# Altium schematic sheet pca10028_connectors.SchDoc: PCA10028 - Connectors
size A4; Revision: 1.0.0; SheetNumber: 4; SheetTotal: 5; DrawnBy: RUBR; ProjectNumber: 4403; PCBRevision: 0169RUBR; DocumentSize: A4; PCAName: PCA10028; PCBNumber: 400092; ProjectName: Cost optimized nRF51-EK
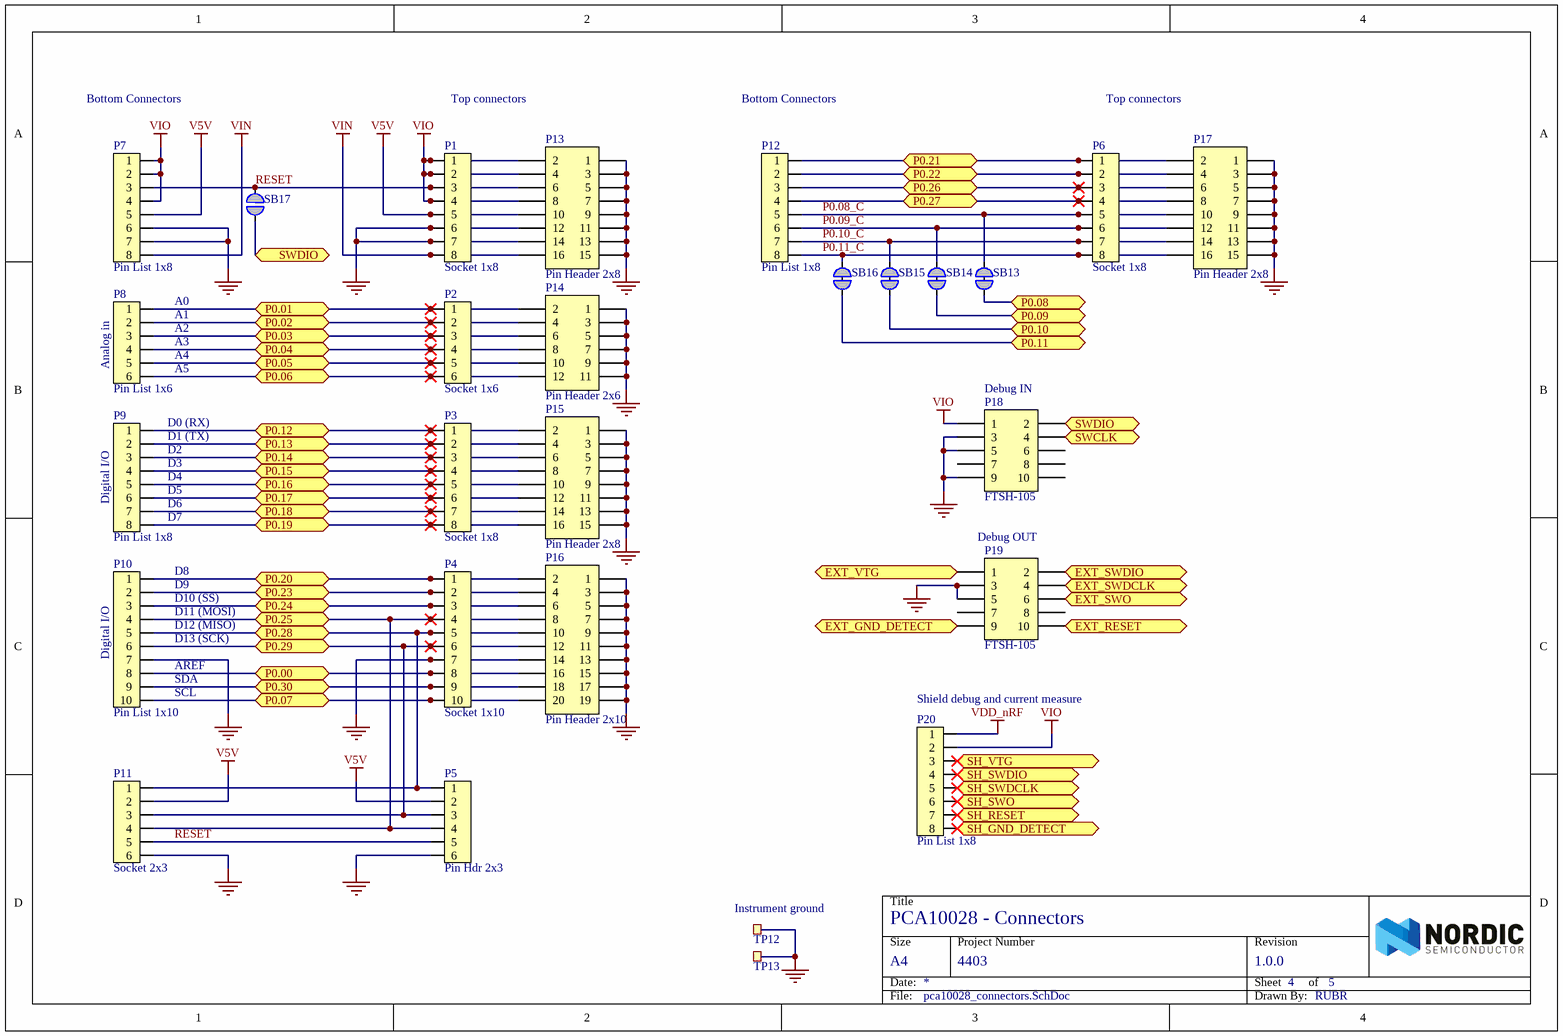
[diagram p0: pca10028_connectors.SchDoc]

## Parts
P1  Socket 1x8  [SOCKET_1x8_SMD]
P2  Socket 1x6  [SOCKET_1x6_SMD]
P3  Socket 1x8  [SOCKET_1x8_SMD]
P4  Socket 1x10  [SOCKET_1x10_SMD]
P5  Pin Hdr 2x3  [Molex 15-91-2060]
P6  Socket 1x8  [SOCKET_1x8_SMD]
P7  Pin List 1x8  [LIST_1x8_SMD]
P8  Pin List 1x6  [LIST_1x6_SMD]
P9  Pin List 1x8  [LIST_1x8_SMD]
P10  Pin List 1x10  [LIST_1x10_SMD]
P11  Socket 2x3  [SOCKET_2x3_SMD-2.54mm-bottom]
P12  Pin List 1x8  [LIST_1x8_SMD]
P13  Pin Header 2x8  [HDR_2x8]
P14  Pin Header 2x6  [HDR_2x6]
P15  Pin Header 2x8  [HDR_2x8]
P16  Pin Header 2x10  [HDR_2x10]
P17  Pin Header 2x8  [HDR_2x8]
P18  FTSH-105  [FTSH-105-K]
P19  FTSH-105  [FTSH-105-K]
P20  Pin List 1x8  [LIST_1x8_SMD]
SB13  Solderbridge  [Solderbridge_Shorted]  (value not drawn)  (net tie, no BOM)
SB14  Solderbridge  [Solderbridge_Shorted]  (value not drawn)  (net tie, no BOM)
SB15  Solderbridge  [Solderbridge_Shorted]  (value not drawn)  (net tie, no BOM)
SB16  Solderbridge  [Solderbridge_Shorted]  (value not drawn)  (net tie, no BOM)
SB17  Solderbridge  [Solderbridge]  (value not drawn)  (no BOM)
TP12  TP  [TESTPAD-TH]  (value not drawn)  (no BOM)
TP13  TP  [TESTPAD-TH]  (value not drawn)  (no BOM)

## Ports
EXT_GND_DETECT (bidir), EXT_RESET (bidir), EXT_SWDCLK (bidir), EXT_SWDIO (bidir), EXT_SWO (bidir), EXT_VTG (bidir), P0.00 (bidir), P0.01 (bidir), P0.02 (bidir), P0.03 (bidir), P0.04 (bidir), P0.05 (bidir), P0.06 (bidir), P0.07 (bidir), P0.08 (bidir), P0.09 (bidir), P0.10 (bidir), P0.11 (bidir), P0.12 (bidir), P0.13 (bidir), P0.14 (bidir), P0.15 (bidir), P0.16 (bidir), P0.17 (bidir), P0.18 (bidir), P0.19 (bidir), P0.20 (bidir), P0.21 (bidir), P0.22 (bidir), P0.23 (bidir), P0.24 (bidir), P0.25 (bidir), P0.26 (bidir), P0.27 (bidir), P0.28 (bidir), P0.29 (bidir), P0.30 (bidir), SH_GND_DETECT (bidir), SH_RESET (bidir), SH_SWDCLK (bidir), SH_SWDIO (bidir), SH_SWO (bidir), SH_VTG (bidir), SWCLK (out), SWDIO (bidir)

## Nets
GND: P1.6 P1.7 P4.7 P5.6 P7.6 P7.7 P10.7 P11.6 P13.1 P13.3 P13.5 P13.7 P13.9 P13.11 P13.12 P13.13 P13.14 P13.15 P14.1 P14.3 P14.5 P14.7 P14.9 P14.11 P15.1 P15.3 P15.5 P15.7 P15.9 P15.11 P15.13 P15.15 P16.1 P16.3 P16.5 P16.7 P16.9 P16.11 P16.13 P16.14 P16.15 P16.17 P16.19 P17.1 P17.3 P17.5 P17.7 P17.9 P17.11 P17.13 P17.15 P18.3 P18.5 P18.9 P19.3 P19.5 TP12.1 TP13.1
V5V: P1.5 P5.2 P7.5 P11.2 P13.10
VDD_nRF: P20.1
VIN: P1.8 P7.8 P13.16
VIO: P1.1 P1.2 P1.4 P7.1 P7.2 P7.4 P13.2 P13.4 P13.8 P18.1 P20.2
EXT_GND_DETECT: P19.9 ; port EXT_GND_DETECT
EXT_RESET: P19.10 ; port EXT_RESET
EXT_SWDCLK: P19.4 ; port EXT_SWDCLK
EXT_SWDIO: P19.2 ; port EXT_SWDIO
EXT_SWO: P19.6 ; port EXT_SWO
EXT_VTG: P19.1 ; port EXT_VTG
P0.00: P4.8 P10.8 P16.16 ; port P0.00
P0.01: P2.1 P8.1 P14.2 ; port P0.01
P0.02: P2.2 P8.2 P14.4 ; port P0.02
P0.03: P2.3 P8.3 P14.6 ; port P0.03
P0.04: P2.4 P8.4 P14.8 ; port P0.04
P0.05: P2.5 P8.5 P14.10 ; port P0.05
P0.06: P2.6 P8.6 P14.12 ; port P0.06
P0.07: P4.10 P10.10 P16.20 ; port P0.07
P0.08: SB13.2 ; port P0.08
P0.08_C: P6.5 P12.5 P17.10 SB13.1
P0.09: SB14.2 ; port P0.09
P0.09_C: P6.6 P12.6 P17.12 SB14.1
P0.10: SB15.2 ; port P0.10
P0.10_C: P6.7 P12.7 P17.14 SB15.1
P0.11: SB16.2 ; port P0.11
P0.11_C: P6.8 P12.8 P17.16 SB16.1
P0.12: P3.1 P9.1 P15.2 ; port P0.12
P0.13: P3.2 P9.2 P15.4 ; port P0.13
P0.14: P3.3 P9.3 P15.6 ; port P0.14
P0.15: P3.4 P9.4 P15.8 ; port P0.15
P0.16: P3.5 P9.5 P15.10 ; port P0.16
P0.17: P3.6 P9.6 P15.12 ; port P0.17
P0.18: P3.7 P9.7 P15.14 ; port P0.18
P0.19: P3.8 P9.8 P15.16 ; port P0.19
P0.20: P4.1 P10.1 P16.2 ; port P0.20
P0.21: P6.1 P12.1 P17.2 ; port P0.21
P0.22: P6.2 P12.2 P17.4 ; port P0.22
P0.23: P4.2 P10.2 P16.4 ; port P0.23
P0.24: P4.3 P10.3 P16.6 ; port P0.24
P0.25: P4.4 P5.4 P10.4 P11.4 P16.8 ; port P0.25
P0.26: P6.3 P12.3 P17.6 ; port P0.26
P0.27: P6.4 P12.4 P17.8 ; port P0.27
P0.28: P4.5 P5.1 P10.5 P11.1 P16.10 ; port P0.28
P0.29: P4.6 P5.3 P10.6 P11.3 P16.12 ; port P0.29
P0.30: P4.9 P10.9 P16.18 ; port P0.30
RESET: P1.3 P5.5 P7.3 P11.5 P13.6 SB17.1
SH_GND_DETECT: P20.8 ; port SH_GND_DETECT
SH_RESET: P20.7 ; port SH_RESET
SH_SWDCLK: P20.5 ; port SH_SWDCLK
SH_SWDIO: P20.4 ; port SH_SWDIO
SH_SWO: P20.6 ; port SH_SWO
SH_VTG: P20.3 ; port SH_VTG
SWCLK: P18.4 ; port SWCLK
SWDIO: P18.2 SB17.2 ; port SWDIO

Not connected (* = marked no-connect by the designer): P18 6 7 8 10; P19 7 8

## Notes on the sheet
- Bottom Connectors
- Top connectors
- A0
- (near P8) Analog in
- (near P8) A1
- (near P8) A2
- (near P8) A3
- (near P8) A4
- (near P8) A5
- (near P9) D0 (RX)
- (near P9) D1 (TX)
- (near P18) Debug IN
- (near P9) Digital I/O
- (near P9) D2
- (near P9) D3
- (near P9) D4
- (near P9) D5
- (near P9) D6
- (near P9) D7
- D8
- (near P19) Debug OUT
- (near P10) Digital I/O
- (near P10) D9
- (near P10) D10 (SS)
- (near P10) D11 (MOSI)
- (near P10) D12 (MISO)
- (near P10) D13 (SCK)
- (near P10) AREF
- (near P10) SDA
- (near P10) SCL
- (near P20) Shield debug and current measure
- (near TP12) Instrument ground
- Title
- Size
- Date:
- Project Number
- Sheet         of
- Revision
- File:
- Drawn By:

## Library data of the parts
P1 P3 P6 = Socket 1x8 SMD: Socket 1x8, 2.54mm (100mil), SMD; Manufacturer: Samtec; Manufacturer Part Number: SSM-108-F-SV-P-TR; 2nd source part number: S5639-ND; Artikkelnr Noca: 55019256; Artikkelnr Simpro: N.A.; Part Number: Socket 1x8 SMD; Datasheet: http://www.samtec.com/documents/webfiles/pdf/SSM_SM.PDF; LatestRevisionDate: 2013-08-27; Publisher: Nordic Semiconductor; Published: 2013-08-27; Value: Socket 1x8; Note: *; Supplier: Samtec; Supplier part number: SSM-108-F-SV-P-TR; 2nd source Supplier: Digi-Key; Pin Count: 8; Footprint Doc: SOCKET_1x8_SMD
P2 = Socket 1x6 SMD: Socket 1x6, 2.54mm (100mil), SMD; Manufacturer: Samtec; Manufacturer Part Number: SSM-106-F-SV-P-TR; 2nd source part number: S5637-ND; Artikkelnr Noca: 55019249; Artikkelnr Simpro: N.A.; Part Number: Socket 1x6 SMD; Datasheet: http://www.samtec.com/documents/webfiles/pdf/SSM_SM.PDF; LatestRevisionDate: 2013-06-05; Pin Count: 6; Publisher: Nordic Semiconductor; Published: 2013-06-05; Value: Socket 1x6; Note: *; Supplier: Samtec; Supplier part number: SSM-106-F-SV-P-TR; 2nd source Supplier: Digi-Key; Footprint Doc: SOCKET_1x6_SMD
P4 = Socket 1x10 SMD: Socket 1x10, 2.54mm (100mil), SMD; Manufacturer: Samtec; Manufacturer Part Number: SSM-110-F-SV-P-TR; 2nd source part number: S5641-ND; Artikkelnr Noca: 55019257; Artikkelnr Simpro: N.A.; Part Number: Socket 1x10 SMD; Datasheet: http://www.samtec.com/documents/webfiles/pdf/SSM_SM.PDF; LatestRevisionDate: 2013-08-27; Pin Count: 10; Publisher: Nordic Semiconductor; Published: 2013-08-27; Value: Socket 1x10; Note: *; Supplier: Samtec; Supplier part number: SSM-110-F-SV-P-TR; 2nd source Supplier: Digi-Key; Footprint Doc: SOCKET_1x10_SMD
P5 = Pin Header 2x3 SMD: Pin Header 2x3, 2.54mm (100mil) SMD; Manufacturer: Molex; 2nd source part number: TSM-103-01-L-DV; Artikkelnr Noca: 55019229; Artikkelnr Simpro: N.A.; Part Number: Pin Header 2x3 SMD; Manufacturer Part Number: 15-91-2060; Datasheet: http://www.molex.com/pdm_docs/sd/015912060_sd.pdf; LatestRevisionDate: 2013-09-20; Pin Count: 6; Publisher: Nordic Semiconductor; Published: 2011-07-01; Value: Pin Hdr 2x3; Note: SMD; Supplier: Digi-Key; Supplier part number: WM17449-ND; 2nd source Supplier: Samtec; Footprint Doc: Molex 15-91-2060
P7 P9 P12 = Pin List 1x8 SMD: Pin List 1x8, 2.54mm (100mil), SMD; Note: Not mounted; Artikkelnr Noca: 55019253; Artikkelnr Simpro: N.A.; Part Number: Pin List 1x8 SMD; Manufacturer: *; Manufacturer Part Number: *; Datasheet: *; LatestRevisionDate: 2013-08-27; Publisher: Nordic Semiconductor; Published: 2013-08-27; Value: Pin List 1x8; Supplier: Samtec; Supplier part number: TSM-108-01-L-SV-P-TR; 2nd source Supplier: *; 2nd source part number: *; Pin Count: 8; Footprint Doc: LIST_1x8_SMD
P8 = Pin List 1x6 SMD: Pin List 1x6, 2.54mm (100mil), SMD; Note: Not mounted; Artikkelnr Noca: 55019252; Artikkelnr Simpro: N.A.; Part Number: Pin List 1x6 SMD; Manufacturer: *; Manufacturer Part Number: *; Datasheet: *; LatestRevisionDate: 2013-08-27; Pin Count: 6; Publisher: Nordic Semiconductor; Published: 2013-08-27; Value: Pin List 1x6; Supplier: Samtec; Supplier part number: TSM-106-01-L-SV-P-TR; 2nd source Supplier: *; 2nd source part number: *; Footprint Doc: LIST_1x6_SMD
P10 = Pin List 1x10 SMD: Pin List 1x10, 2.54mm (100mil), SMD; Note: Not mounted; Artikkelnr Noca: 55019254; Artikkelnr Simpro: N.A.; Part Number: Pin List 1x10 SMD; Manufacturer: *; Manufacturer Part Number: *; Datasheet: *; LatestRevisionDate: 2013-08-27; Publisher: Nordic Semiconductor; Published: 2013-08-27; Value: Pin List 1x10; Supplier: Samtec; Supplier part number: TSM-110-01-L-SV-P-TR; 2nd source Supplier: *; 2nd source part number: *; Pin Count: 10; Footprint Doc: LIST_1x10_SMD
P11 = Socket 2x3 SMD Bottom: Socket 2x3, 2.54mm (100mil), SMD; Manufacturer: Samtec; Manufacturer Part Number: SSM-103-F-DV-P-TR; 2nd source part number: S5712-ND; Note: Not mounted; Artikkelnr Noca: 55019255; Artikkelnr Simpro: N.A.; Part Number: Socket 2x3 SMD Bottom; Datasheet: http://www.samtec.com/documents/webfiles/pdf/SSM_SM.PDF; LatestRevisionDate: 2014-06-10; Pin Count: 6; Publisher: Nordic Semiconductor; Published: 2014-06-10; Value: Socket 2x3; Supplier: Samtec; Supplier part number: SSM-103-F-DV-P-TR; 2nd source Supplier: Digi-Key; Footprint Doc: SOCKET_2x3_SMD-2.54mm-bottom
P13 P15 P17 = Pin Header 2x8: Pin Header 2x8, 2.54mm (100mil); Note: Not mounted; Artikkelnr Noca: N.A.; Part Number: Pin Header 2x8; Manufacturer: *; Manufacturer Part Number: *; Datasheet: *; Footprint Doc: HDR_2x8; LatestRevisionDate: 2009-12-12; Pin Count: 16; Publisher: Nordic Semiconductor; Published: 2009-12-12; Value: Pin Header 2x8; Supplier: *; Supplier part number: *; 2nd source Supplier: *; 2nd source part number: *; Artikkelnr Simpro: N.A.
P14 = Pin Header 2x6: Pin Header 2x6, 2.54mm (100mil); Note: Not mounted; Artikkelnr Noca: N.A.; Part Number: Pin Header 2x6; Manufacturer: *; Manufacturer Part Number: *; Datasheet: *; Footprint Doc: HDR_2x6; LatestRevisionDate: 2014-07-04; Pin Count: 12; Publisher: Nordic Semiconductor; Published: 2009-12-12; Value: Pin Header 2x6; Supplier: *; Supplier part number: *; 2nd source Supplier: *; 2nd source part number: *; Artikkelnr Simpro: N.A.
P16 = Pin Header 2x10: Pin Header 2x10, 2.54mm (100mil); Note: Not mounted; Artikkelnr Noca: N.A.; Part Number: Pin Header 2x10; Manufacturer: *; Manufacturer Part Number: *; Datasheet: *; Footprint Doc: HDR_2x10; LatestRevisionDate: 2014-07-04; Pin Count: 20; Publisher: Nordic Semiconductor; Published: 2009-12-12; Value: Pin Header 2x10; Supplier: *; Supplier part number: *; 2nd source Supplier: *; 2nd source part number: *; Artikkelnr Simpro: N.A.
P18 P19 = Samtec FTSH-105 Keying Shroud: SAMTEC - CONN HEADER 10POS DUAL .05" SMD KEYING SHROUD; Manufacturer Part Number: FTSH-105-01-F-DV-K; Note: HEADER, 1.27MM, SMD, 10WAY, Keying Shroud; Artikkelnr Noca: N.A.; Part Number: Samtec FTSH-105 Keying Shroud; Manufacturer: Samtec; Datasheet: http://www.digikey.com/product-detail/en/FTSH-105-01-F-DV-K-P-TR/FTSH-105-01-F-DV-K-P-TR-ND/2649977; LatestRevisionDate: 2014-05-23; Pin Count: 10; Publisher: Nordic Semiconductor; Published: 2014-05-23; Value: FTSH-105; Supplier: Digi-Key; Supplier part number: FTSH-105-01-F-DV-K-P-TR-ND; 2nd source Supplier: *; 2nd source part number: *; Footprint Doc: FTSH-105; Artikkelnr Simpro: N.A.
P20 = Pin List 1x8 SMD: Pin List 1x8, 2.54mm (100mil), SMD; Artikkelnr Noca: 55019253; Artikkelnr Simpro: N.A.; Part Number: Pin List 1x8 SMD; Manufacturer: *; Manufacturer Part Number: *; Datasheet: *; LatestRevisionDate: 2013-08-27; Pin Count: 8; Publisher: Nordic Semiconductor; Published: 2013-08-27; Value: Pin List 1x8; Note: *; Supplier: Samtec; Supplier part number: TSM-108-01-L-SV-P-TR; 2nd source Supplier: *; 2nd source part number: *; Footprint Doc: LIST_1x8_SMD
SB13-SB16 = Solderbridge Shorted: Shorted Solderbridge; Artikkelnr Noca: N.A.; Part Number: Solderbridge Shorted; Manufacturer: *; Manufacturer Part Number: *; Datasheet: *; Footprint Doc: Solderbridge_Shorted; LatestRevisionDate: 2012-08-07; Pin Count: 2; Publisher: Nordic Semiconductor; Published: 2012-08-07; Value: Solderbridge; Note: *; Supplier: *; Supplier part number: *; 2nd source Supplier: *; 2nd source part number: *; Artikkelnr Simpro: N.A.
SB17 = Solderbridge: Artikkelnr Noca: N.A.; Part Number: Solderbridge; Manufacturer: *; Manufacturer Part Number: *; Datasheet: *; Footprint Doc: Solderbridge; LatestRevisionDate: 2009-12-14; Pin Count: 2; Publisher: Nordic Semiconductor; Published: 2009-12-14; Value: Solderbridge; Note: *; Supplier: *; Supplier part number: *; 2nd source Supplier: *; 2nd source part number: *; Artikkelnr Simpro: N.A.
TP12 TP13 = Testpoint TH: Testpoint, through hole; Artikkelnr Noca: N.A.; Part Number: Testpoint TH; Manufacturer: *; Manufacturer Part Number: *; Datasheet: *; Footprint Doc: TESTPAD-TH; LatestRevisionDate: 2009-12-12; Pin Count: 1; Publisher: Nordic Semiconductor; Published: 2009-12-12; Value: TP; Note: *; Supplier: *; Supplier part number: *; 2nd source Supplier: *; 2nd source part number: *; Artikkelnr Simpro: N.A.